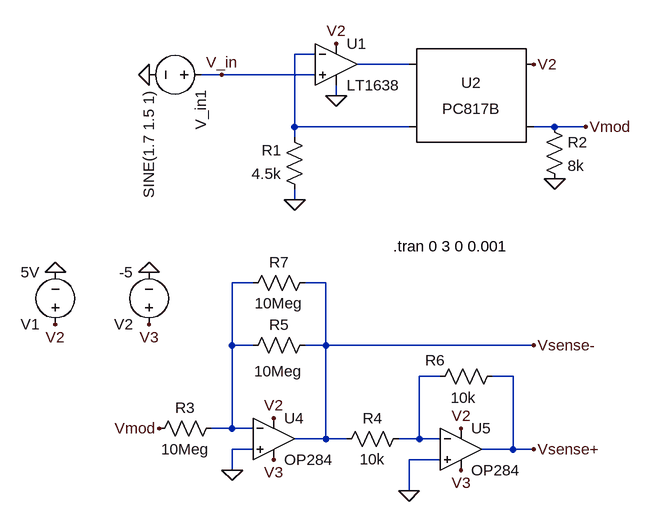
[diagram p0: schematic Part2_Circuit.asc]
Part2_Circuit.asc, the LTspice schematic file:
Version 4
SHEET 1 1076 924
WIRE -48 144 -80 144
WIRE 96 160 16 160
WIRE -192 176 -224 176
WIRE -48 176 -192 176
WIRE -16 208 -16 192
WIRE -80 256 -80 144
WIRE 96 256 -80 256
WIRE 320 256 288 256
WIRE 368 256 320 256
WIRE -80 272 -80 256
WIRE -80 368 -80 352
WIRE -144 496 -176 496
WIRE -32 496 -64 496
WIRE -176 592 -176 496
WIRE -144 592 -176 592
WIRE -32 592 -32 496
WIRE -32 592 -64 592
WIRE 288 592 -32 592
WIRE 144 640 112 640
WIRE 256 640 224 640
WIRE -176 720 -176 592
WIRE -176 720 -208 720
WIRE -144 720 -176 720
WIRE -32 736 -32 592
WIRE -32 736 -80 736
WIRE 0 736 -32 736
WIRE 112 736 112 640
WIRE 112 736 80 736
WIRE 144 736 112 736
WIRE -144 752 -176 752
WIRE 256 752 256 640
WIRE 256 752 208 752
WIRE 288 752 256 752
WIRE 144 768 96 768
WIRE -176 784 -176 752
WIRE 96 816 96 768
FLAG -304 176 0
FLAG -80 368 0
FLAG -16 208 0
FLAG 288 160 V2
FLAG -16 128 V2
FLAG -192 176 V_in
FLAG -448 560 V2
FLAG -448 480 0
FLAG -304 560 V3
FLAG -304 480 0
FLAG 320 336 0
FLAG -176 784 0
FLAG 96 816 0
FLAG -112 704 V2
FLAG 176 720 V2
FLAG -112 768 V3
FLAG 176 784 V3
FLAG 288 592 Vsense-
FLAG 288 752 Vsense+
FLAG 368 256 Vmod
FLAG -288 720 Vmod
SYMBOL voltage -208 176 R90
WINDOW 123 0 0 Left 0
WINDOW 39 0 0 Left 0
SYMATTR InstName V_in1
SYMATTR Value SINE(1.7 1.5 1)
SYMBOL res -64 368 R180
WINDOW 0 36 76 Left 2
WINDOW 3 36 40 Left 2
SYMATTR InstName R1
SYMATTR Value 4.5k
SYMBOL OpAmps\\LT1638 -16 96 R0
SYMATTR InstName U1
SYMBOL Optos\\PC817B 192 208 R0
SYMATTR InstName U2
SYMBOL voltage -448 576 R180
WINDOW 123 0 0 Left 0
WINDOW 39 0 0 Left 0
SYMATTR InstName V1
SYMATTR Value 5V
SYMBOL voltage -304 576 R180
WINDOW 123 0 0 Left 0
WINDOW 39 0 0 Left 0
SYMATTR InstName V2
SYMATTR Value -5
SYMBOL res 304 240 R0
SYMATTR InstName R2
SYMATTR Value 8k
SYMBOL res -192 704 R90
WINDOW 0 0 56 VBottom 2
WINDOW 3 32 56 VTop 2
SYMATTR InstName R3
SYMATTR Value 10Meg
SYMBOL Opamps\\OP284 -112 672 R0
SYMATTR InstName U4
SYMBOL Opamps\\OP284 176 688 R0
SYMATTR InstName U5
SYMBOL res 96 720 R90
WINDOW 0 0 56 VBottom 2
WINDOW 3 32 56 VTop 2
SYMATTR InstName R4
SYMATTR Value 10k
SYMBOL res -48 576 R90
WINDOW 0 0 56 VBottom 2
WINDOW 3 40 57 VTop 2
SYMATTR InstName R5
SYMATTR Value 10Meg
SYMBOL res 240 624 R90
WINDOW 0 7 104 VBottom 2
WINDOW 3 33 60 VTop 2
SYMATTR InstName R6
SYMATTR Value 10k
SYMBOL res -48 480 R90
WINDOW 0 0 56 VBottom 2
WINDOW 3 32 56 VTop 2
SYMATTR InstName R7
SYMATTR Value 10Meg
TEXT 72 440 Left 2 !.tran 0 3 0 0.001

The netlist it stands for:
* Part2_Circuit.asc
V_in1 V_in 0 SINE(1.7 1.5 1)
R1 0 N001 4.5k
XU1 V_in N001 V2 0 N002 LT1638  ; pins In+ In- V+ V- OUT
XU2 N002 N001 V2 Vmod PC817 Igain=1.5m
V1 V2 0 5V
V2 V3 0 -5
R2 Vmod 0 8k
R3 N003 Vmod 10Meg
XU4 0 N003 V2 V3 Vsense- OP284  ; pins In+ In- V+ V- OUT
XU5 0 N004 V2 V3 Vsense+ OP284  ; pins In+ In- V+ V- OUT
R4 N004 Vsense- 10k
R5 Vsense- N003 10Meg
R6 Vsense+ N004 10k
R7 Vsense- N003 10Meg
.tran 0 3 0 0.001
.lib PC817.sub
.lib ADI1.lib
.backanno
.end